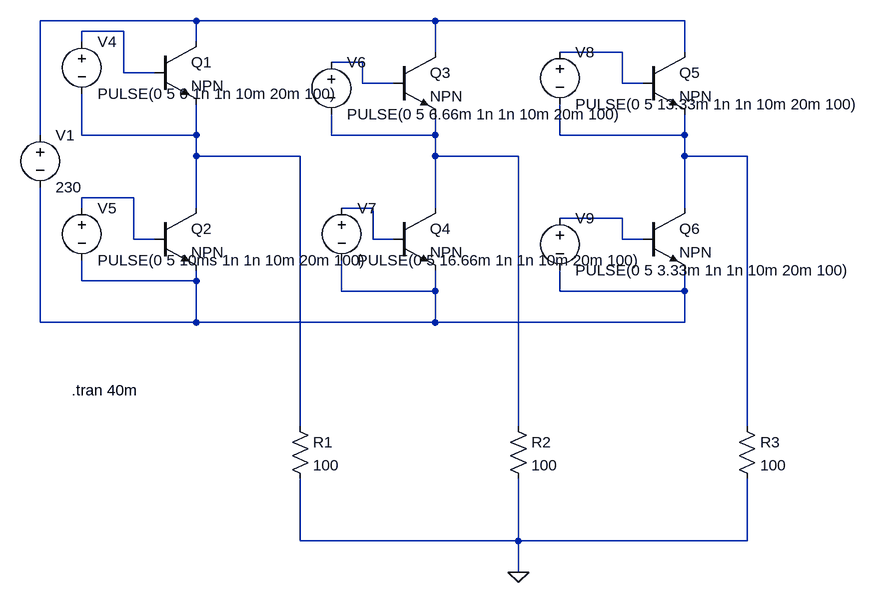
[diagram p0: schematic 3phaseinverter.asc]
3phaseinverter.asc, the LTspice schematic file:
Version 4
SHEET 1 1724 1184
WIRE 560 64 320 64
WIRE 928 64 560 64
WIRE 1312 64 928 64
WIRE 448 80 384 80
WIRE 384 96 384 80
WIRE 560 96 560 64
WIRE 928 112 928 64
WIRE 1216 112 1120 112
WIRE 1312 112 1312 64
WIRE 816 128 768 128
WIRE 448 144 448 80
WIRE 496 144 448 144
WIRE 816 160 816 128
WIRE 864 160 816 160
WIRE 1216 160 1216 112
WIRE 1248 160 1216 160
WIRE 320 240 320 64
WIRE 384 240 384 176
WIRE 560 240 560 192
WIRE 560 240 384 240
WIRE 768 240 768 208
WIRE 928 240 928 208
WIRE 928 240 768 240
WIRE 1120 240 1120 192
WIRE 1312 240 1312 208
WIRE 1312 240 1120 240
WIRE 560 272 560 240
WIRE 720 272 560 272
WIRE 928 272 928 240
WIRE 1056 272 928 272
WIRE 1312 272 1312 240
WIRE 1408 272 1312 272
WIRE 464 336 384 336
WIRE 384 352 384 336
WIRE 560 352 560 272
WIRE 832 352 784 352
WIRE 928 352 928 272
WIRE 1312 352 1312 272
WIRE 1216 368 1120 368
WIRE 464 400 464 336
WIRE 496 400 464 400
WIRE 832 400 832 352
WIRE 864 400 832 400
WIRE 1216 400 1216 368
WIRE 1248 400 1216 400
WIRE 384 464 384 432
WIRE 560 464 560 448
WIRE 560 464 384 464
WIRE 784 480 784 432
WIRE 928 480 928 448
WIRE 928 480 784 480
WIRE 1120 480 1120 448
WIRE 1312 480 1312 448
WIRE 1312 480 1120 480
WIRE 320 528 320 320
WIRE 560 528 560 464
WIRE 560 528 320 528
WIRE 928 528 928 480
WIRE 928 528 560 528
WIRE 1312 528 1312 480
WIRE 1312 528 928 528
WIRE 720 688 720 272
WIRE 1056 688 1056 272
WIRE 1408 688 1408 272
WIRE 720 864 720 768
WIRE 1056 864 1056 768
WIRE 1056 864 720 864
WIRE 1408 864 1408 768
WIRE 1408 864 1056 864
WIRE 1056 912 1056 864
FLAG 1056 912 0
SYMBOL npn 496 96 R0
SYMATTR InstName Q1
SYMBOL npn 496 352 R0
SYMATTR InstName Q2
SYMBOL npn 864 112 R0
SYMATTR InstName Q3
SYMBOL npn 864 352 R0
SYMATTR InstName Q4
SYMBOL npn 1248 112 R0
SYMATTR InstName Q5
SYMBOL npn 1248 352 R0
SYMATTR InstName Q6
SYMBOL voltage 320 224 R0
SYMATTR InstName V1
SYMATTR Value 230
SYMBOL res 704 672 R0
SYMATTR InstName R1
SYMATTR Value 100
SYMBOL res 1040 672 R0
SYMATTR InstName R2
SYMATTR Value 100
SYMBOL res 1392 672 R0
SYMATTR InstName R3
SYMATTR Value 100
SYMBOL voltage 384 80 R0
SYMATTR InstName V4
SYMATTR Value PULSE(0 5 0 1n 1n 10m 20m 100)
SYMBOL voltage 384 336 R0
SYMATTR InstName V5
SYMATTR Value PULSE(0 5 10ms 1n 1n 10m 20m 100)
SYMBOL voltage 768 112 R0
SYMATTR InstName V6
SYMATTR Value PULSE(0 5 6.66m 1n 1n 10m 20m 100)
SYMBOL voltage 784 336 R0
SYMATTR InstName V7
SYMATTR Value PULSE(0 5 16.66m 1n 1n 10m 20m 100)
SYMBOL voltage 1120 96 R0
SYMATTR InstName V8
SYMATTR Value PULSE(0 5 13.33m 1n 1n 10m 20m 100)
SYMBOL voltage 1120 352 R0
SYMATTR InstName V9
SYMATTR Value PULSE(0 5 3.33m 1n 1n 10m 20m 100)
TEXT 368 632 Left 2 !.tran 40m

The netlist it stands for:
* 3phaseinverter.asc
Q1 N001 N002 N005 0 NPN
Q2 N005 N008 N011 0 NPN
Q3 N001 N004 N006 0 NPN
Q4 N006 N009 N011 0 NPN
Q5 N001 N003 N007 0 NPN
Q6 N007 N010 N011 0 NPN
V1 N001 N011 230
R1 N005 0 100
R2 N006 0 100
R3 N007 0 100
V4 N002 N005 PULSE(0 5 0 1n 1n 10m 20m 100)
V5 N008 N011 PULSE(0 5 10ms 1n 1n 10m 20m 100)
V6 N004 N006 PULSE(0 5 6.66m 1n 1n 10m 20m 100)
V7 N009 N011 PULSE(0 5 16.66m 1n 1n 10m 20m 100)
V8 N003 N007 PULSE(0 5 13.33m 1n 1n 10m 20m 100)
V9 N010 N011 PULSE(0 5 3.33m 1n 1n 10m 20m 100)
.model NPN NPN
.model PNP PNP
.lib standard.bjt
.tran 40m
.backanno
.end